# Altium project ts_20-Trolley-Discharge-Module.PrjPcb
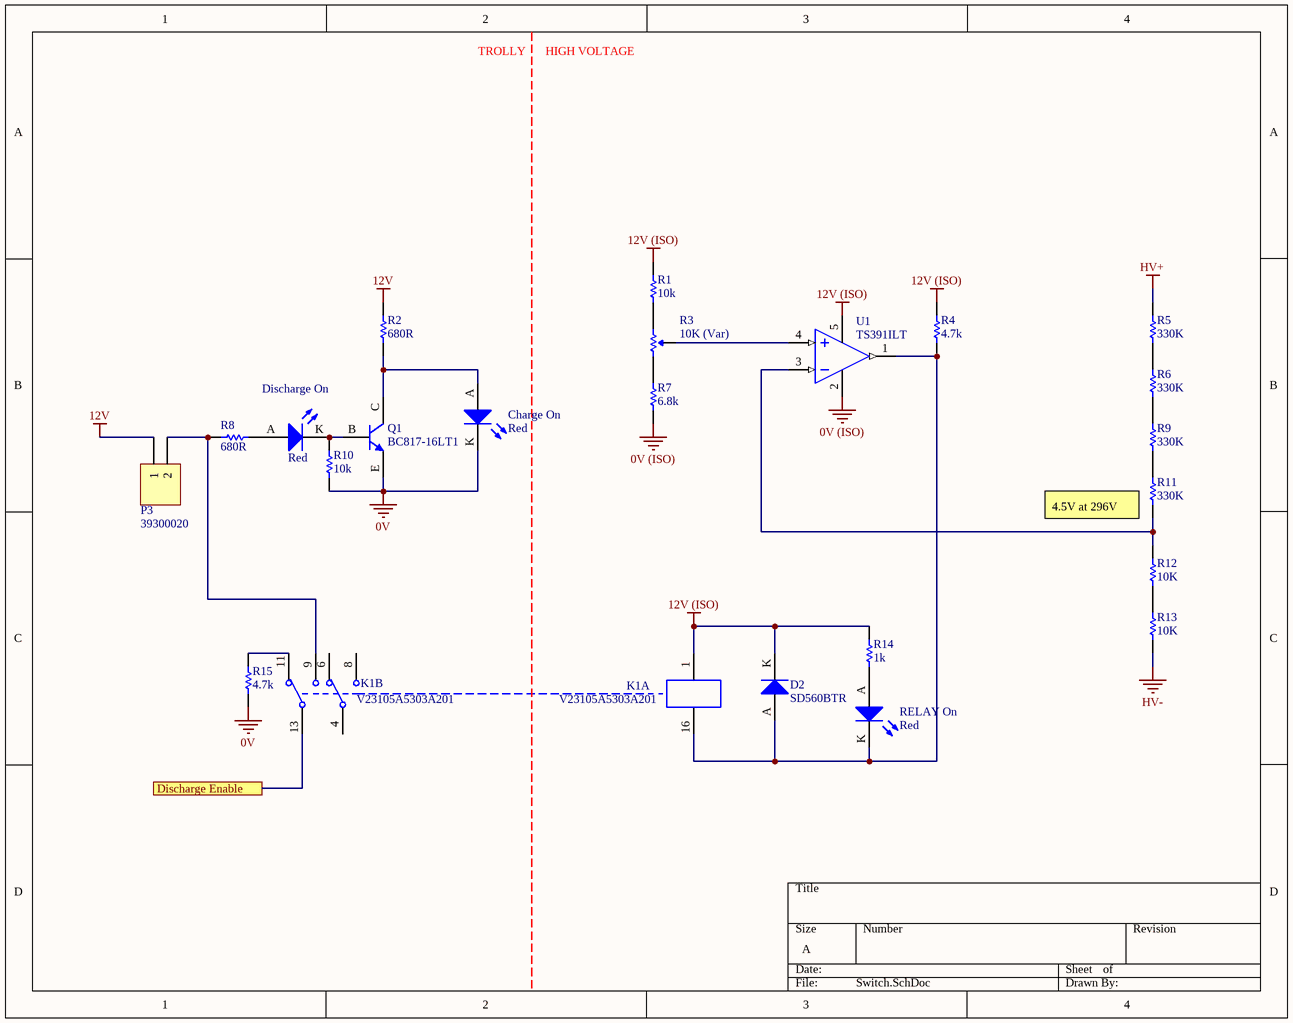
[diagram p0: Switch.SchDoc]
1 sheet, 23 parts. Net scope: flat (ports and power ports of the same name join across sheets).
Board file: PCB.PcbDoc

## Sheet Switch.SchDoc
size A

### Parts
Charge_On  Red  [0805 LED]
D2  SD560BTR  [SMB Diode]
Discharge_On  Red  [0805 LED]
K1  V23105A5303A201  [TI 2-DIL]  (parts A,B of 2)
P3  39300020  [39300020]
Q1  BC817-16LT1  [ON SOT-23 BJT]
R1  10k  [0805]
R2  680R  [0805]
R3  10K (Var)  [B 3296]
R4  4.7k  [0805]
R5  330K  [VB 0204]
R6  330K  [VB 0204]
R7  6.8k  [0805]
R8  680R  [0805]
R9  330K  [VB 0204]
R10  10k  [0805]
R11  330K  [VB 0204]
R12  10K  [VB 0204]
R13  10K  [VB 0204]
R14  1k  [0805]
R15  4.7k  [0805]
RELAY_On  Red  [0805 LED]
U1  TS391ILT  [ON SOT-23-5]

### Ports
Discharge Enable

### Nets
0V: Charge_On.K Q1.E R10.1 R15.2
0V (ISO): R7.1 U1.2(VCC-)
12V: P3.1 R2.2
12V (ISO): D2.K K1.1 R1.2 R4.2 R14.2 U1.5(VCC+)
HV+: R5.2
HV-: R13.1
NetCharge_On_A: Charge_On.A Q1.C R2.1
NetD2_A: D2.A K1.16 R4.1 RELAY_On.K U1.1(OUT)
NetDischarge_On_A: Discharge_On.A R8.1
NetDischarge_On_K: Discharge_On.K Q1.B R10.2
NetK1_9: K1.9 P3.2 R8.2
NetK1_11: K1.11 R15.1
NetK1_13: K1.13 ; port Discharge Enable
NetR1_1: R1.1 R3.1(CCW)
NetR3_2: R3.2(Wiper) U1.4(IIN+)
NetR3_3: R3.3(CW) R7.2
NetR5_1: R5.1 R6.2
NetR6_1: R6.1 R9.2
NetR9_1: R9.1 R11.2
NetR11_1: R11.1 R12.2 U1.3(IN-)
NetR12_1: R12.1 R13.2
NetR14_1: R14.1 RELAY_On.A

Not connected (* = marked no-connect by the designer): K1 4 6 8

### Notes on the sheet
- TROLLY
- HIGH VOLTAGE
- (near R11) 4.5V at 296V

### Library data of the parts
Charge_On Discharge_On RELAY_On = SML-210LTT86: Red LED Indication - Discrete 1.75V 0805 (2012 Metric); Manufacturer: ROHM Semiconductor; Part Number: SML-210LTT86; Colour: Red; Digikey Part Number: 511-1286-1-ND; Digikey Link: https://www.digikey.com/product-detail/en/rohm-semiconductor/SML-210LTT86/511-1286-1-ND/637099
D2 = SD560BTR: 1.2V_F 600V 5A SMB; Manufacturer: SMC Diode Solutions; Part Number: SD560BTR; Digikey Part Number: 1655-1530-2-ND; Digikey Link: https://www.digikey.com/product-detail/en/smc-diode-solutions/SD560BTR/1655-1530-2-ND/6022620
K1 = V23105A5303A201: RELAY TELECOM DPDT 3A 12V; Manufacturer: TE Connectivity; Part Number: V23105A5303A201; Digikey Part Number: PB387-ND; Digikey Link: https://www.digikey.com/product-detail/en/te-connectivity-potter-brumfield-relays/V23105A5303A201/PB387-ND/291023
P3 = 39300020: Pitch: 4.2mm; Row Spacing: 5.5mm; Angle: 90; Flange: No; Contact: Tin; Part Number: 39300020; Positions: 2; Digikey Part Number: WM21351-ND
Q1 = BC817-16LT1: 300mW  BJT NPN Transistor; Manufacturer: ON Semiconductor; Part Number: BC817-16LT1; Digikey Part Number: BC817-16LT1OSTR-ND; Digikey Link: https://www.digikey.com.au/product-detail/en/on-semiconductor/BC817-16LT1/BC817-16LT1OSTR-ND/606178
R1 R10 = RC0805FR0710KL: Manufacturer: YAGEO; Tolerance: 0.01; Rated Voltage: 0.125W; Part Number: RC0805FR0710KL; Value: 10k; Material: FR-07; Digikey Part Number: 311-10.0KCRCT-ND
R2 R8 = RC0805FR07680RL: Manufacturer: YAGEO; Tolerance: 0.01; Rated Voltage: 0.125W; Part Number: RC0805FR07680RL; Value: 680R; Material: FR-07; Digikey Part Number: 311-680CRCT-ND
R3 = 3296W-1-103LF: Manufacturer: Bournes Inc; Tolerance: 0.1; Rated Voltage: 0.5W; Part Number: 3296W-1-103LF; Value: 10K (Var); Digikey Part Number: 3296W-103LF-ND
R4 R15 = RC0805FR074K7L: Manufacturer: YAGEO; Tolerance: 0.01; Rated Voltage: 0.125W; Part Number: RC0805FR074K7L; Value: 4.7k; Material: FR-07; Digikey Part Number: 311-4.70KCRCT-ND
R5 R6 R9 R11 = MMA02040C3303FB300: Manufacturer: Vishay Beyschlag; Tolerance: 0.01; Rated Voltage: 0.4W; Part Number: MMA02040C3303FB300; Value: 330K; Digikey Part Number: MMA-330KACT-ND
R7 = RC0805FR076K8L: Manufacturer: YAGEO; Tolerance: 0.01; Rated Voltage: 0.125W; Part Number: RC0805FR076K8L; Value: 6.8k; Material: FR-07; Digikey Part Number: 311-6.80KCRCT-ND
R12 R13 = MMA02040C1002FB300: Manufacturer: Vishay Beyschlag; Tolerance: 0.01; Rated Voltage: 0.4W; Part Number: MMA02040C1002FB300; Value: 10K; Digikey Part Number: MMA-10KACT-ND
R14 = RC0805FR071KL: Manufacturer: YAGEO; Tolerance: 0.01; Rated Voltage: 0.125W; Part Number: RC0805FR071KL; Value: 1k; Material: FR-07; Digikey Part Number: 311-1.00KCRCT-ND
U1 = TS391ILT: IC COMP LO PWR SGL V SOT 23-5L; Manufacturer: STMicroelectronics; Part Number: TS391ILT; Digikey Part Number: 497-2275-2-ND; Digikey Link: https://www.digikey.com/product-detail/en/stmicroelectronics/TS391ILT/497-2275-2-ND/599407